# EAGLE design adapter_1.0 (EAGLE 7.6.0)
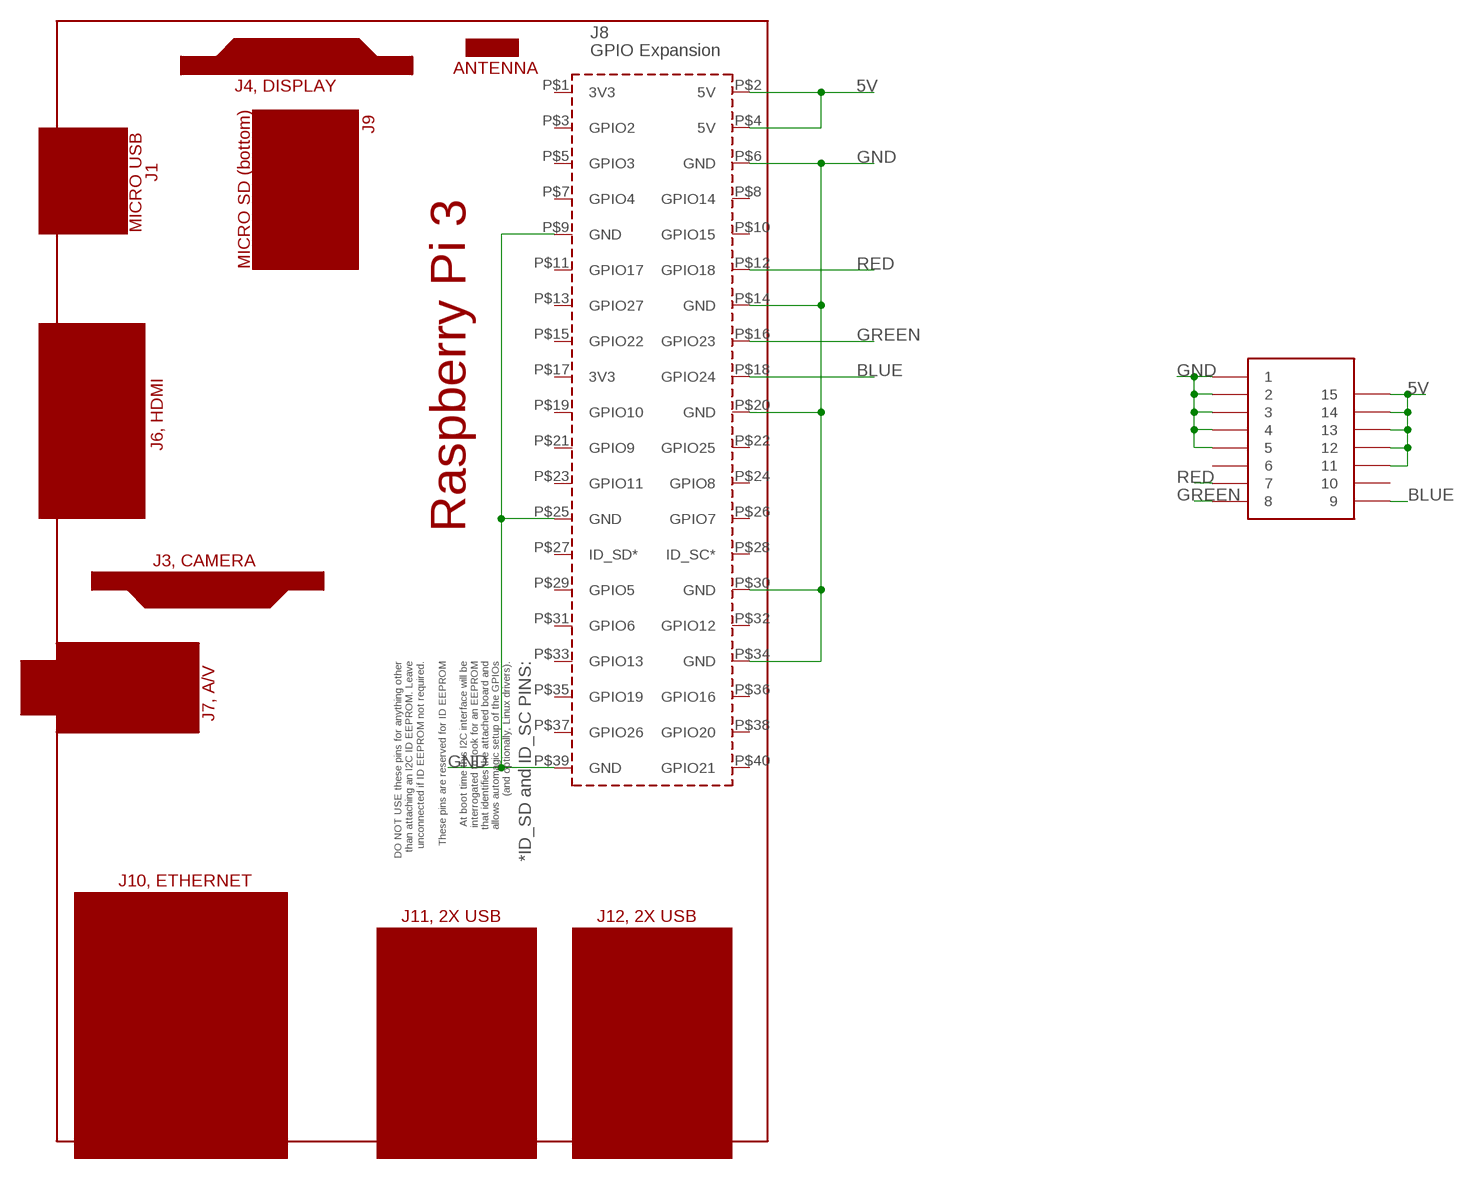
[diagram p0: schematic, sheet 1]

## Parts
J1  DB15  [DB15R]
PCB1  RPI3  [RPI3]

## Nets
5V: J1.P11 J1.P12 J1.P13 J1.P14 J1.P15 PCB1.P$2(5V) PCB1.P$4(5V)
BLUE: J1.P9 PCB1.P$18(GPIO24)
GND: J1.P1 J1.P2 J1.P3 J1.P4 J1.P5 PCB1.P$6(GND) PCB1.P$9(GND) PCB1.P$14(GND) PCB1.P$20(GND) PCB1.P$25(GND) PCB1.P$30(GND) PCB1.P$34(GND) PCB1.P$39(GND)
GREEN: J1.P8 PCB1.P$16(GPIO23)
RED: J1.P7 PCB1.P$12(GPIO18)
Unconnected: J1.P6 J1.P10 PCB1.P$1(3V3) PCB1.P$3(GPIO2) PCB1.P$5(GPIO3) PCB1.P$7(GPIO4) PCB1.P$8(GPIO14) PCB1.P$10(GPIO15) PCB1.P$11(GPIO17) PCB1.P$13(GPIO27) PCB1.P$15(GPIO22) PCB1.P$17(3V3) PCB1.P$19(GPIO10) PCB1.P$21(GPIO9) PCB1.P$22(GPIO25) PCB1.P$23(GPIO11) PCB1.P$24(GPIO8) PCB1.P$26(GPIO7) PCB1.P$27(ID_SD*) PCB1.P$28(ID_SC*) PCB1.P$29(GPIO5) PCB1.P$31(GPIO6) PCB1.P$32(GPIO12) PCB1.P$33(GPIO13) PCB1.P$35(GPIO19) PCB1.P$36(GPIO16) PCB1.P$37(GPIO26) PCB1.P$38(GPIO20) PCB1.P$40(GPIO21)

## Library data of the parts
J1 = rpilib:DB15
PCB1 = e14_Rpi3_RevA:RPI3: Device for Raspberry Pi 3 board created by Dave Young for www.element14.com More information and support community is available at https://www.element14.com/community/community/raspberry-pi

## Board
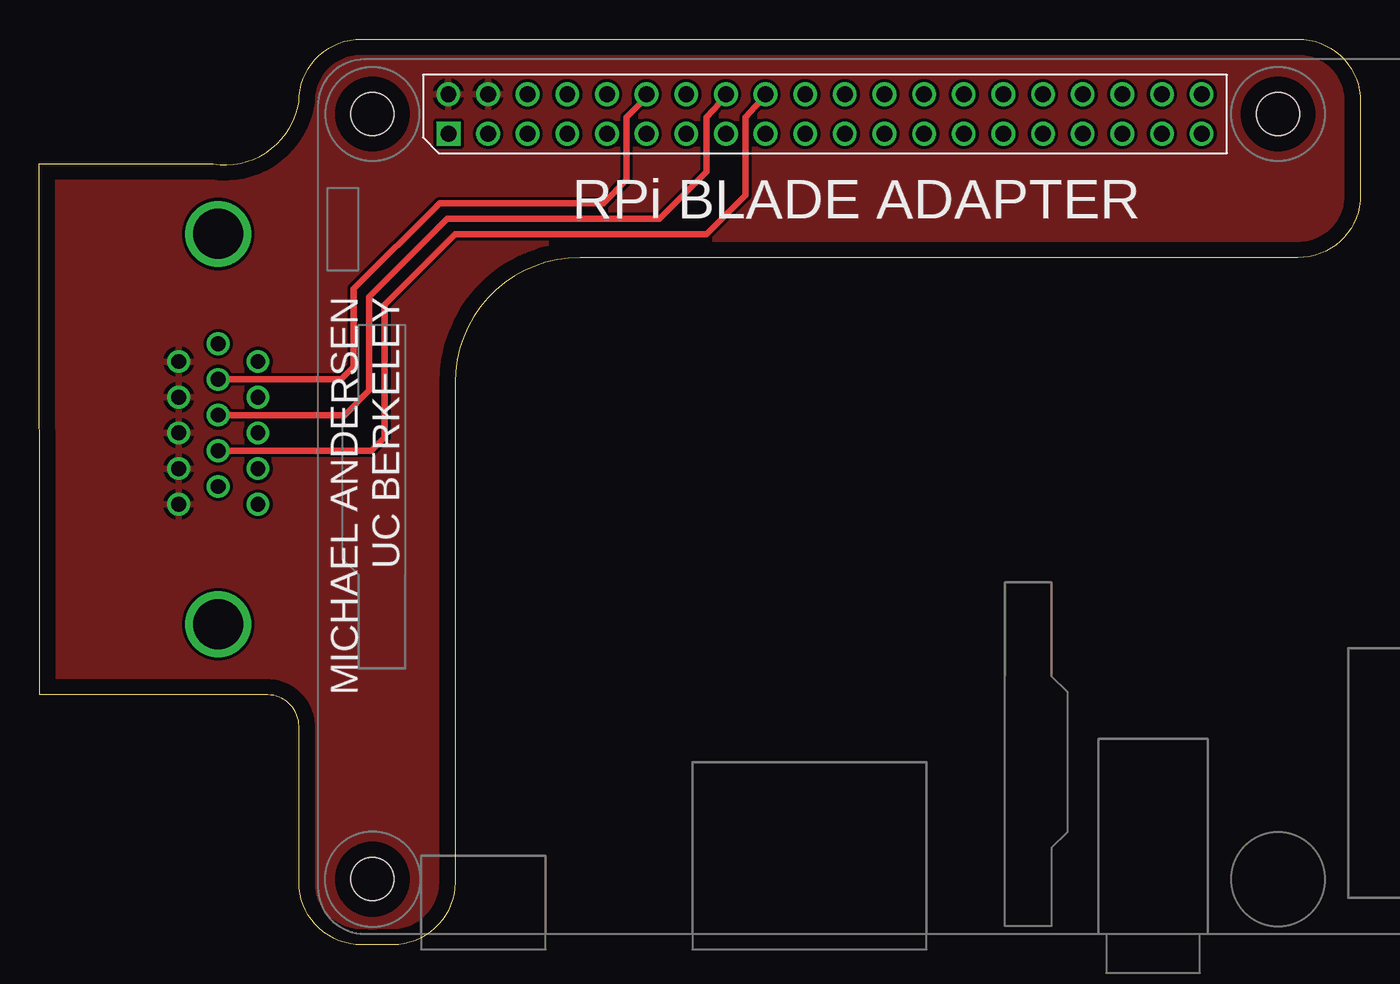
[diagram p1: board, top side]
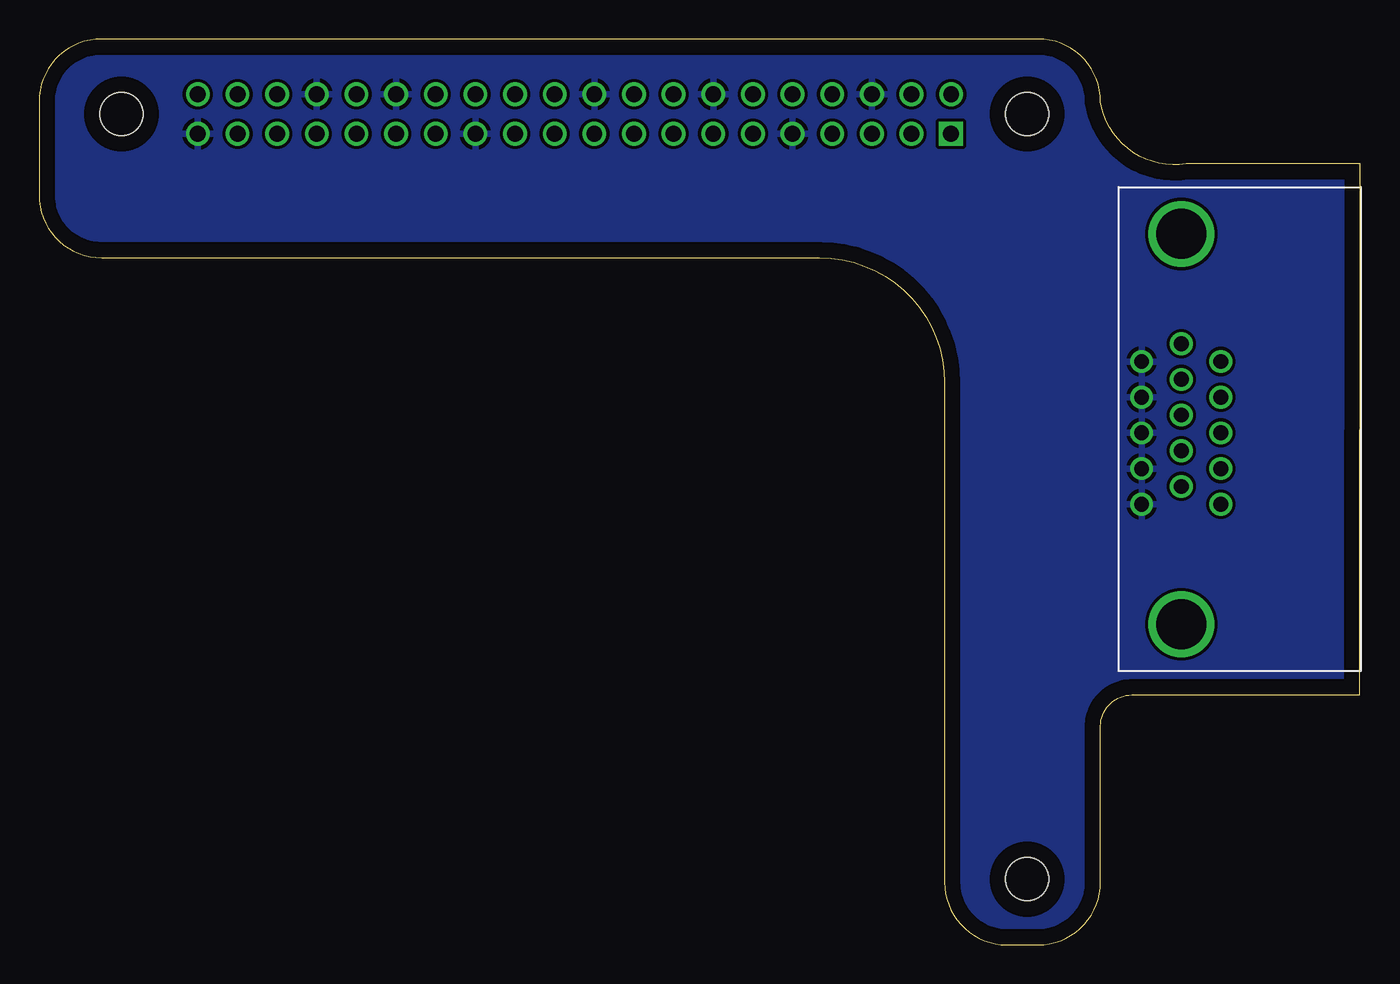
[diagram p2: board, bottom side, seen from below]

Size 84.65 x 58 mm. Coordinates in mm from the lower left corner, seen from the top.
Outline: 0,50 11.15,50 arc90 16.65,54 arc-90 20.65,58 80.65,58 arc-90 84.65,54 84.65,48 arc-90 80.65,44 34.65,44 arc90 26.65,36 26.65,4 arc-90 22.65,0 20.65,0 arc-90 16.65,4 16.65,14 arc90 14.65,16 0.05,16 0,50
Copper layers (1*16): Top 0.035mm / dielectric 1.5mm / Bottom 0.035mm
Design rules "default": minimum track width 10mil, minimum drill 24mil, track to track 8mil, track to pad 8mil, pad to pad 8mil, via to via 8mil, smd to smd 8mil, copper to edge 40mil, drill to drill 8mil, minimum pad ring 10mil, minimum via ring 8mil, stop-mask expansion 4mil, vias tented up to drill 0mil, thermal gap 10mil

### Footprints (pad centres in the part's own frame; a part is rotated, then mirrored left to right if it is on the bottom)
DB15R = drill 0.95: P1 4.323,2.54; P2 2.038,2.54; P3 -0.247,2.54; P4 -2.532,2.54; P5 -4.817,2.54; P6 5.465,0; P7 3.18,0; P8 0.895,0; P9 -1.389,0; P10 -3.675,0; P11 4.323,-2.54; P12 2.038,-2.54; P13 -0.247,-2.54; P14 -2.532,-2.54; P15 -4.817,-2.54 | drill 3.2: P$1 -12.497,0; P$17 12.493,0
RPI3 = drill 1.016 square: P$1 8.37,51.23 | drill 1.016: P$2 8.357,53.772; P$3 10.897,51.232; P$4 10.897,53.772; P$5 13.437,51.232; P$6 13.437,53.772; P$7 15.977,51.232; P$8 15.977,53.772; P$9 18.517,51.232; P$10 18.517,53.772; P$11 21.057,51.232; P$12 21.057,53.772; P$13 23.597,51.232; P$14 23.597,53.772; P$15 26.137,51.232; P$16 26.137,53.772; P$17 28.677,51.232; P$18 28.677,53.772; P$19 31.217,51.232; P$20 31.217,53.772; P$21 33.757,51.232; P$22 33.757,53.772; P$23 36.297,51.232; P$24 36.297,53.772; P$25 38.837,51.232; P$26 38.837,53.772; P$27 41.377,51.232; P$28 41.377,53.772; P$29 43.917,51.232; P$30 43.917,53.772; P$31 46.457,51.232; P$32 46.457,53.772; P$33 48.997,51.232; P$34 48.997,53.772; P$35 51.537,51.232; P$36 51.537,53.772; P$37 54.077,51.232; P$38 54.077,53.772; P$39 56.617,51.232; P$40 56.617,53.772 | hole 2.75: 3.5,3.5; 3.5,52.5; 61.5,52.5

### Placement (x,y rotation side)
J1  11.48,33.02 90 bottom
PCB1  17.86,0.7 0 top

### Tracks (layer width: path | path; a pad name or v marks a point on that pad's centre or on a via)
5V
  pour Top: 0.15,50 11.15,50 arc90 16.65,54 arc-90 20.65,58 80.65,58 arc-90 84.65,54 84.65,48 arc-90 80.65,44 34.65,44 arc90 26.65,36 26.65,4 arc-90 22.65,0 20.65,0 arc-90 16.65,4 16.65,14 arc90 14.65,16 0.15,16
BLUE
  Top 0.406: PCB1.P$18 46.54,54.39 45.25,53 45.25,48 42.75,45.5 26.65,45.5 22.15,41 22.15,32.5 21.29,31.64 J1.P9
GND
  pour Bottom: 0.15,50 11.15,50 arc90 16.65,54 arc-90 20.65,58 80.65,58 arc-90 84.65,54 84.65,48 arc-90 80.65,44 34.65,44 arc90 26.65,36 26.65,4 arc-90 22.65,0 20.65,0 arc-90 16.65,4 16.65,14 arc90 14.65,16 0.15,16
GREEN
  Top 0.406: PCB1.P$16 44,54.35 42.75,53 42.75,49.5 39.75,46.5 26.15,46.5 21.15,41.5 21.15,35.5 19.57,33.92 J1.P8
RED
  Top 0.406: PCB1.P$12 38.92,54.27 37.65,53 37.65,49 36.15,47.5 25.65,47.5 20.15,42 20.15,37 19.36,36.21 J1.P7

### Text on the board
tPlace: RPi BLADE ADAPTER | MICHAEL ANDERSEN / UC BERKELEY